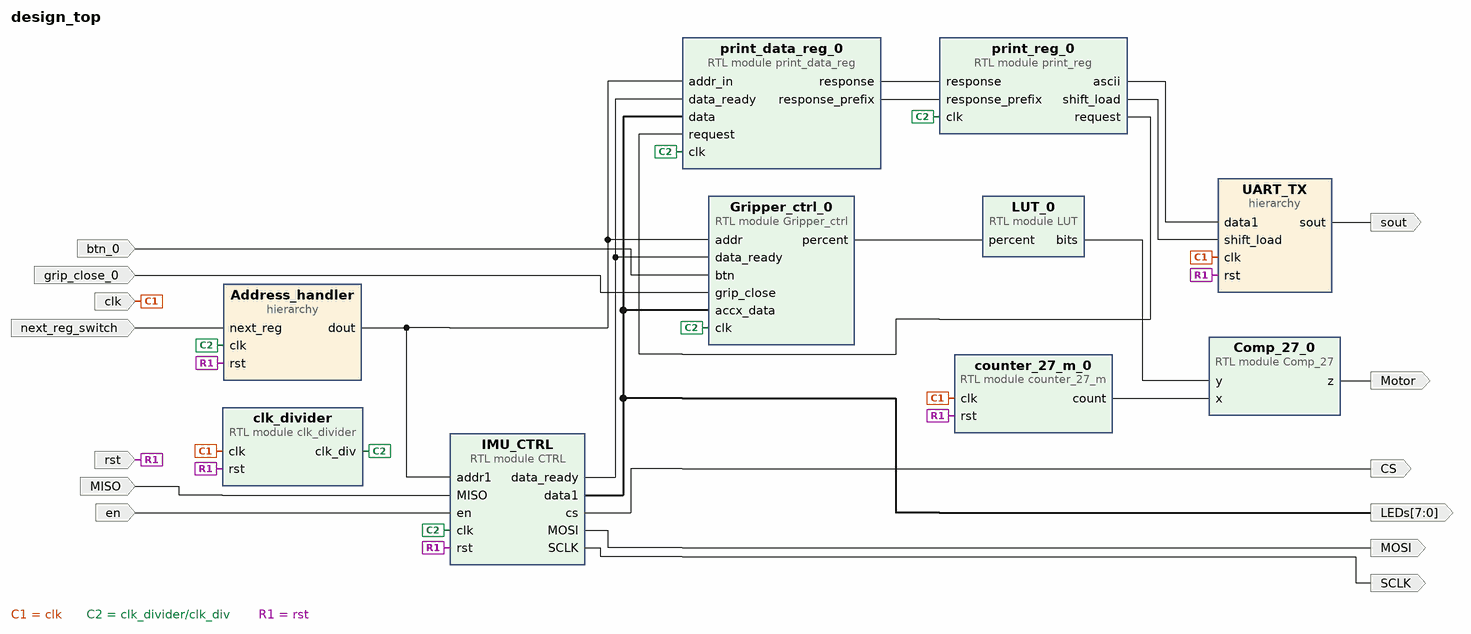
[diagram p0: block diagram of the top level]
# Vivado block design design_top, xc7z020clg400-1, Vivado 2021.1
create_bd_design design_top

create_bd_port -dir I -type clk clk
create_bd_port -dir I -type rst rst
create_bd_port -dir I en
create_bd_port -dir O CS
create_bd_port -dir I MISO
create_bd_port -dir O MOSI
create_bd_port -dir O SCLK
create_bd_port -dir O -from 7 -to 0 LEDs
create_bd_port -dir I next_reg_switch
create_bd_port -dir O sout
create_bd_port -dir O Motor
create_bd_port -dir I btn_0
create_bd_port -dir I grip_close_0

create_bd_cell -type hier Address_handler
create_bd_cell -type hier UART_TX
create_bd_cell -type module -reference clk_divider clk_divider
create_bd_cell -type module -reference CTRL IMU_CTRL
create_bd_cell -type module -reference LUT LUT_0
create_bd_cell -type module -reference Comp_27 Comp_27_0
create_bd_cell -type module -reference counter_27_m counter_27_m_0
create_bd_cell -type module -reference print_data_reg print_data_reg_0
create_bd_cell -type module -reference print_reg print_reg_0
create_bd_cell -type module -reference Gripper_ctrl Gripper_ctrl_0

# ---- hierarchy /Address_handler ----
current_bd_instance /Address_handler
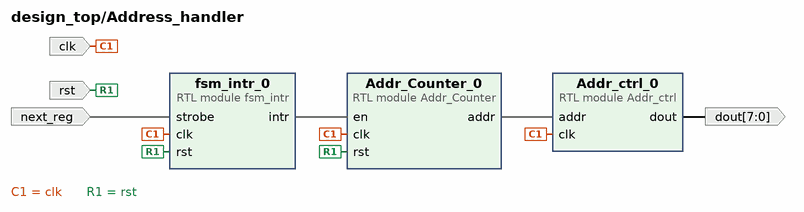
[diagram p1: block diagram inside /Address_handler]
create_bd_pin -dir I -type clk clk
create_bd_pin -dir O -from 7 -to 0 dout
create_bd_pin -dir I -type rst rst
create_bd_pin -dir I next_reg

create_bd_cell -type module -reference Addr_Counter Addr_Counter_0
create_bd_cell -type module -reference fsm_intr fsm_intr_0
create_bd_cell -type module -reference Addr_ctrl Addr_ctrl_0

# ---- hierarchy /UART_TX ----
current_bd_instance /UART_TX
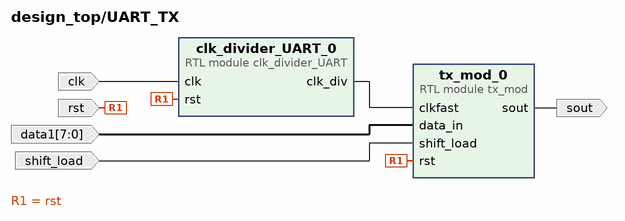
[diagram p2: block diagram inside /UART_TX]
create_bd_pin -dir I -type clk clk
create_bd_pin -dir I -type rst rst
create_bd_pin -dir I -from 7 -to 0 data1
create_bd_pin -dir I shift_load
create_bd_pin -dir O sout

create_bd_cell -type module -reference clk_divider_UART clk_divider_UART_0
create_bd_cell -type module -reference tx_mod tx_mod_0

# ---- connections ----

current_bd_instance /Address_handler
connect_bd_net [get_bd_pins Addr_Counter_0/addr] [get_bd_pins Addr_ctrl_0/addr]
connect_bd_net [get_bd_pins Addr_ctrl_0/dout] [get_bd_pins dout]
connect_bd_net -net clk_divider_0_clk_div [get_bd_pins clk] \
  [get_bd_pins Addr_Counter_0/clk] [get_bd_pins fsm_intr_0/clk] [get_bd_pins Addr_ctrl_0/clk]
connect_bd_net [get_bd_pins fsm_intr_0/intr] [get_bd_pins Addr_Counter_0/en]
connect_bd_net -net rst_0_1 [get_bd_pins rst] [get_bd_pins fsm_intr_0/rst] [get_bd_pins Addr_Counter_0/rst]
connect_bd_net -net strobe_0_1 [get_bd_pins next_reg] [get_bd_pins fsm_intr_0/strobe]

current_bd_instance /UART_TX
connect_bd_net -net CTRL_0_data1 [get_bd_pins data1] [get_bd_pins tx_mod_0/data_in]
connect_bd_net -net CTRL_0_data_ready [get_bd_pins shift_load] [get_bd_pins tx_mod_0/shift_load]
connect_bd_net [get_bd_pins clk] [get_bd_pins clk_divider_UART_0/clk]
connect_bd_net [get_bd_pins clk_divider_UART_0/clk_div] [get_bd_pins tx_mod_0/clkfast]
connect_bd_net -net rst_0_1 [get_bd_pins rst] [get_bd_pins clk_divider_UART_0/rst] [get_bd_pins tx_mod_0/rst]
connect_bd_net [get_bd_pins tx_mod_0/sout] [get_bd_pins sout]

current_bd_instance /
connect_bd_net -net Addr_ctrl_0_dout [get_bd_pins Address_handler/dout] \
  [get_bd_pins IMU_CTRL/addr1] [get_bd_pins print_data_reg_0/addr_in] [get_bd_pins Gripper_ctrl_0/addr]
connect_bd_net -net CTRL_0_CS [get_bd_pins IMU_CTRL/cs] [get_bd_ports CS]
connect_bd_net -net CTRL_0_MOSI [get_bd_pins IMU_CTRL/MOSI] [get_bd_ports MOSI]
connect_bd_net -net CTRL_0_SCLK [get_bd_pins IMU_CTRL/SCLK] [get_bd_ports SCLK]
connect_bd_net [get_bd_pins Comp_27_0/z] [get_bd_ports Motor]
connect_bd_net [get_bd_pins Gripper_ctrl_0/percent] [get_bd_pins LUT_0/percent]
connect_bd_net [get_bd_pins IMU_CTRL/data1] [get_bd_ports LEDs] [get_bd_pins print_data_reg_0/data] [get_bd_pins Gripper_ctrl_0/accx_data]
connect_bd_net [get_bd_pins IMU_CTRL/data_ready] [get_bd_pins print_data_reg_0/data_ready] [get_bd_pins Gripper_ctrl_0/data_ready]
connect_bd_net [get_bd_pins LUT_0/bits] [get_bd_pins Comp_27_0/y]
connect_bd_net -net MISO_0_1 [get_bd_ports MISO] [get_bd_pins IMU_CTRL/MISO]
connect_bd_net -net btn_0_1 [get_bd_ports btn_0] [get_bd_pins Gripper_ctrl_0/btn]
connect_bd_net [get_bd_ports clk] [get_bd_pins UART_TX/clk] [get_bd_pins clk_divider/clk] [get_bd_pins counter_27_m_0/clk]
connect_bd_net -net clk_divider_0_clk_div [get_bd_pins clk_divider/clk_div] \
  [get_bd_pins Address_handler/clk] [get_bd_pins IMU_CTRL/clk] [get_bd_pins print_data_reg_0/clk] \
  [get_bd_pins print_reg_0/clk] [get_bd_pins Gripper_ctrl_0/clk]
connect_bd_net [get_bd_pins counter_27_m_0/count] [get_bd_pins Comp_27_0/x]
connect_bd_net -net en_0_1 [get_bd_ports en] [get_bd_pins IMU_CTRL/en]
connect_bd_net -net grip_close_0_1 [get_bd_ports grip_close_0] [get_bd_pins Gripper_ctrl_0/grip_close]
connect_bd_net [get_bd_pins print_data_reg_0/response] [get_bd_pins print_reg_0/response]
connect_bd_net [get_bd_pins print_data_reg_0/response_prefix] [get_bd_pins print_reg_0/response_prefix]
connect_bd_net [get_bd_pins print_reg_0/ascii] [get_bd_pins UART_TX/data1]
connect_bd_net [get_bd_pins print_reg_0/request] [get_bd_pins print_data_reg_0/request]
connect_bd_net [get_bd_pins print_reg_0/shift_load] [get_bd_pins UART_TX/shift_load]
connect_bd_net -net rst_0_1 [get_bd_ports rst] \
  [get_bd_pins Address_handler/rst] [get_bd_pins UART_TX/rst] [get_bd_pins clk_divider/rst] [get_bd_pins IMU_CTRL/rst] \
  [get_bd_pins counter_27_m_0/rst]
connect_bd_net -net strobe_0_1 [get_bd_ports next_reg_switch] [get_bd_pins Address_handler/next_reg]
connect_bd_net -net tx_mod_0_sout [get_bd_pins UART_TX/sout] [get_bd_ports sout]

validate_bd_design
save_bd_design
